# Altium project Lixie_Tube_Holder.PrjPcb
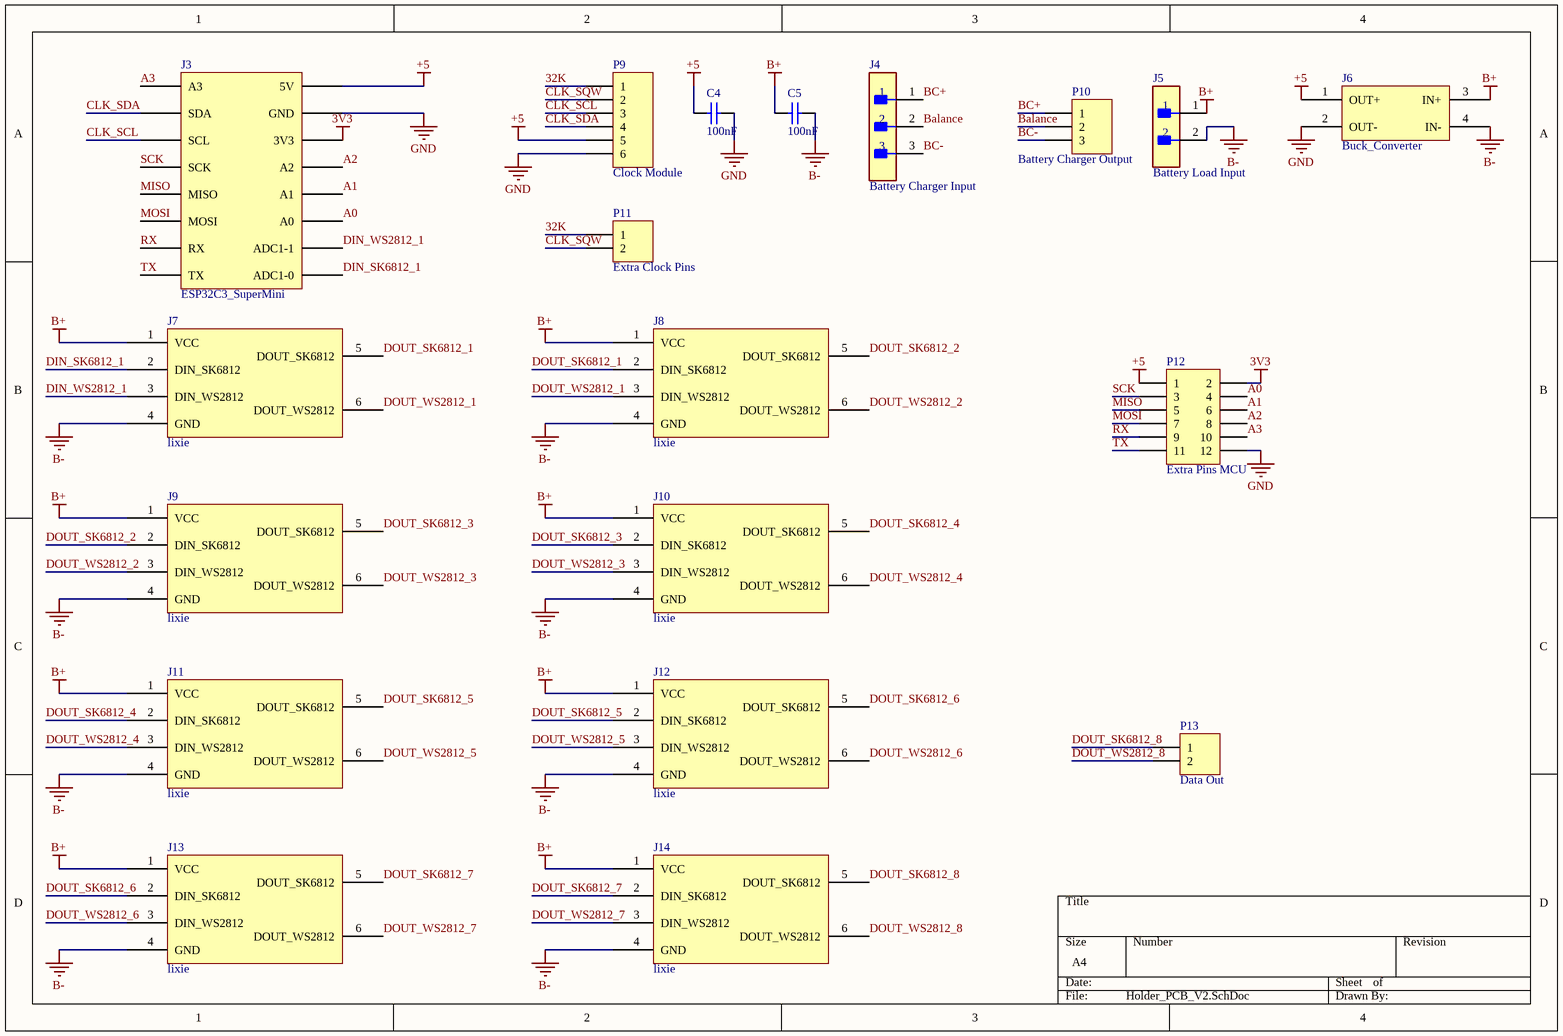
[diagram p0: Holder_PCB_V2.SchDoc]
1 sheet, 19 parts. Net scope: global (net labels, ports and power ports of the same name join across sheets).
Board file: Holder_Base_V3.PcbDoc

## Sheet Holder_PCB_V2.SchDoc
size A4; SheetNumber: 1; SheetTotal: 1

### Parts
C4  100nF  [0805C]
C5  100nF  [0805C]
J3  ESP32C3_SuperMini  [ESP32C3_SuperMini]
J4  Battery Charger Input  [FP-B3B-XH-A_LF_SN-MFG]
J5  Battery Load Input  [FP-B2B-XH-A_LF_SN-MFG]
J6  Buck_Converter  [Buck_Converter]
J7  lixie  [Lixie]
J8  lixie  [Lixie]
J9  lixie  [Lixie]
J10  lixie  [Lixie]
J11  lixie  [Lixie]
J12  lixie  [Lixie]
J13  lixie  [Lixie]
J14  lixie  [Lixie]
P9  Clock Module  [HDR1X6]
P10  Battery Charger Output  [HDR1X3]
P11  Extra Clock Pins  [HDR1X2]
P12  Extra Pins MCU  [HDR2X6]
P13  Data Out  [HDR1X2]

### Nets
3V3: J3.3V3 P12.2
+5: C4.2 J3.5V J6.1(OUT+) P9.5 P12.1
B+: C5.2 J5.1 J6.3(IN+) J7.1(VCC) J8.1(VCC) J9.1(VCC) J10.1(VCC) J11.1(VCC) J12.1(VCC) J13.1(VCC) J14.1(VCC)
B-: C5.1 J5.2 J6.4(IN-) J7.4(GND) J8.4(GND) J9.4(GND) J10.4(GND) J11.4(GND) J12.4(GND) J13.4(GND) J14.4(GND)
GND: C4.1 J3.GND J6.2(OUT-) P9.6 P12.12
32K: P9.1 P11.1
A0: J3.2(A0) P12.4
A1: J3.3(A1) P12.6
A2: J3.4(A2) P12.8
A3: J3.5(A3) P12.10
Balance: J4.2 P10.2
BC+: J4.1 P10.1
BC-: J4.3 P10.3
CLK_SCL: J3.7(SCL) P9.3
CLK_SDA: J3.6(SDA) P9.4
CLK_SQW: P9.2 P11.2
DIN_SK6812_1: J3.0(ADC1-0) J7.2(DIN_SK6812)
DIN_WS2812_1: J3.1(ADC1-1) J7.3(DIN_WS2812)
DOUT_SK6812_1: J7.5(DOUT_SK6812) J8.2(DIN_SK6812)
DOUT_SK6812_2: J8.5(DOUT_SK6812) J9.2(DIN_SK6812)
DOUT_SK6812_3: J9.5(DOUT_SK6812) J10.2(DIN_SK6812)
DOUT_SK6812_4: J10.5(DOUT_SK6812) J11.2(DIN_SK6812)
DOUT_SK6812_5: J11.5(DOUT_SK6812) J12.2(DIN_SK6812)
DOUT_SK6812_6: J12.5(DOUT_SK6812) J13.2(DIN_SK6812)
DOUT_SK6812_7: J13.5(DOUT_SK6812) J14.2(DIN_SK6812)
DOUT_SK6812_8: J14.5(DOUT_SK6812) P13.1
DOUT_WS2812_1: J7.6(DOUT_WS2812) J8.3(DIN_WS2812)
DOUT_WS2812_2: J8.6(DOUT_WS2812) J9.3(DIN_WS2812)
DOUT_WS2812_3: J9.6(DOUT_WS2812) J10.3(DIN_WS2812)
DOUT_WS2812_4: J10.6(DOUT_WS2812) J11.3(DIN_WS2812)
DOUT_WS2812_5: J11.6(DOUT_WS2812) J12.3(DIN_WS2812)
DOUT_WS2812_6: J12.6(DOUT_WS2812) J13.3(DIN_WS2812)
DOUT_WS2812_7: J13.6(DOUT_WS2812) J14.3(DIN_WS2812)
DOUT_WS2812_8: J14.6(DOUT_WS2812) P13.2
MISO: J3.9(MISO) P12.5
MOSI: J3.10(MOSI) P12.7
RX: J3.20(RX) P12.9
SCK: J3.8(SCK) P12.3
TX: J3.21(TX) P12.11

### Library data of the parts
C4 C5 = C: Capacitor; Reviewed by: RM - 2018/08/05; Revision: July-2002: Re-released for DXP Platform.; Supplier 1: *; Supplier Part Number 1: *; Value: 100nF
J4 = CMP-17439-000014-3: CONN HEADER VERT 3POS 2.5MM; Max Voltage Rating (DC): 250V; Number of Positions: 3; Current Rating: 3A; Gender: Male; Wire/Cable Gauge: 22AWG; Contact Resistance: 20mR; Insulation Resistance: 1GR; Insulation Material: Nylon; Contact Plating: Tin; Depth: 5.75mm; Contact Type: Male Pin; Max Operating Temperature: 85°C; Insulation Color: Natural; Voltage Rating (AC): 250V; Color: Natural; Connector Type: Header; Orientation: Straight; Fastening Type: Detent; Housing Color: White; Min Operating Temperature: -25°C; Termination: Solder; Voltage Rating: 250V; Series: XH; Pitch: 2.5mm; Contact Shape: Square; Number of Rows: 1; Lead Free: Lead Free; Packaging: Bulk; Mount: Through Hole; Flammability Rating: UL94 V-0; Max Voltage Rating (AC): 250V; REACH SVHC: No SVHC; Housing Material: Polyamide; Contact Material: Brass; Lead Pitch: 2.5mm; Contact Finish - Mating: TIN; Length: 9.9mm; Max Current Rating: 3A; Number of Contacts: 3
J5 = CMP-2000-05888-3: CONN HEADER VERT 2POS 2.5MM; Current Rating: 3A; Voltage Rating: 250V; Number of Contacts: 2; Contact Resistance: 20mR; Wire/Cable Gauge: 22AWG; Insulation Resistance: 1GR; Connector Type: Male Pin; Packaging: Bulk; Contact Material: Brass; Lead Free: Lead Free; Orientation: Straight; Contact Plating: Tin; Max Current Rating: 3A; Termination: Solder; Fastening Type: Detent; Depth: 5.75mm; Housing Material: Polyamide; REACH SVHC: No SVHC; Series: XH; Voltage Rating (AC): 250V; Number of Positions: 2; Color: Natural; Contact Type: Male Pin; Max Voltage Rating (DC): 250V; Pitch: 2.5mm; Lead Pitch: 2.5mm; Mount: Through Hole; Max Operating Temperature: 85°C; Length: 7.4mm; Max Voltage Rating (AC): 250V; Min Operating Temperature: -25°C; Number of Rows: 1; Housing Color: White
P9 = Header 6: Header, 6-Pin; LatestRevisionDate: 17-Jul-2002; LatestRevisionNote: Re-released for DXP Platform.; Publisher: Altium Limited
P10 = Header 3: Header, 3-Pin; LatestRevisionDate: 17-Jul-2002; LatestRevisionNote: Re-released for DXP Platform.; Publisher: Altium Limited
P11 P13 = Header 2: Header, 2-Pin; LatestRevisionDate: 17-Jul-2002; LatestRevisionNote: Re-released for DXP Platform.; Publisher: Altium Limited
P12 = Header 6X2: Header, 6-Pin, Dual row; LatestRevisionDate: 17-Jul-2002; LatestRevisionNote: Re-released for DXP Platform.; Publisher: Altium Limited